# EAGLE schematic Sensor tile (EAGLE 6.6.0)
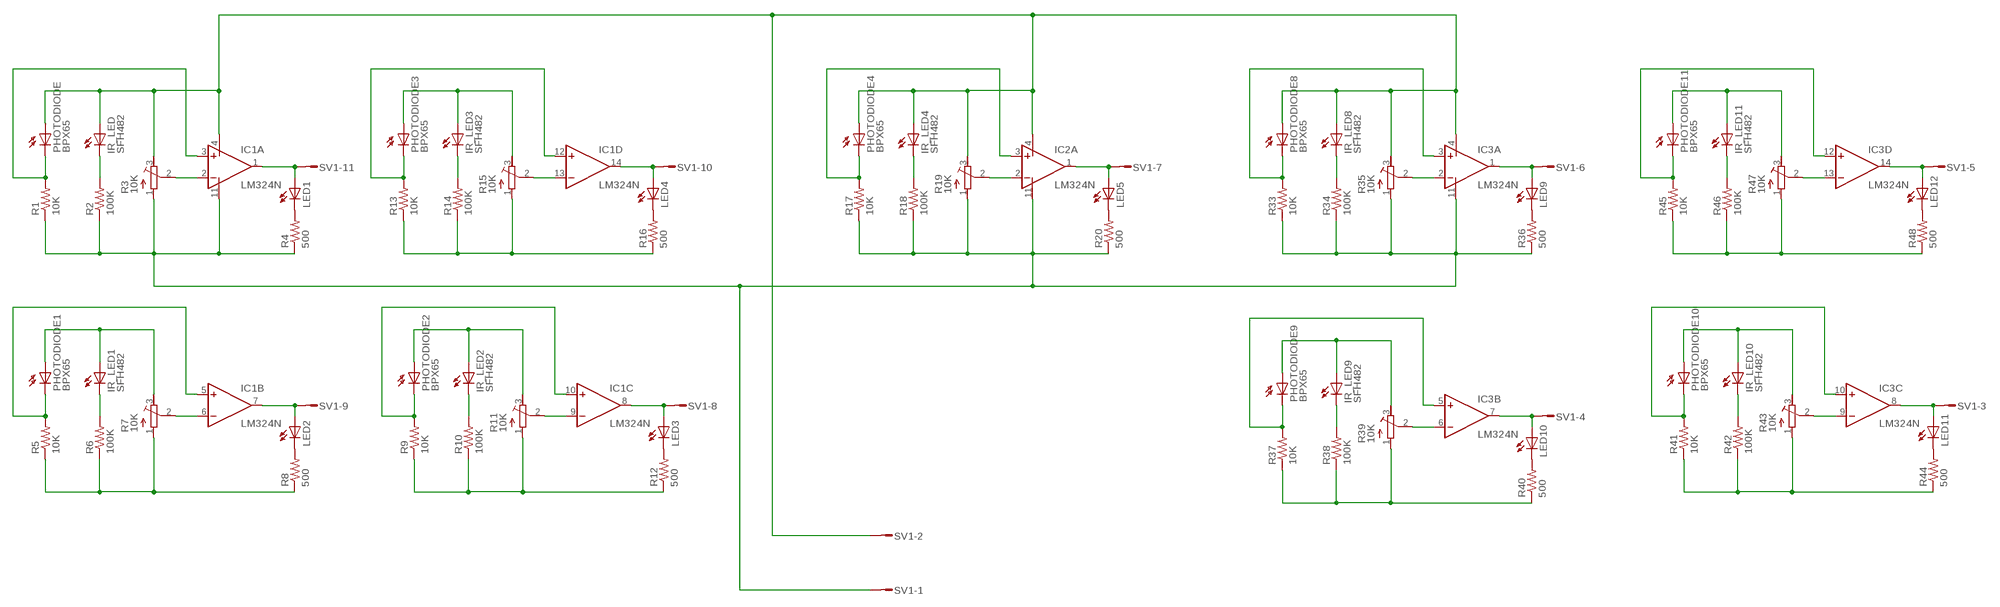
[diagram p0: schematic, sheet 1]

## Parts
IC1  LM324N  [DIL14]
IC2  LM324N  [DIL14]
IC3  LM324N  [DIL14]
IR_LED  SFH482  [SFH482]
IR_LED1  SFH482  [SFH482]
IR_LED2  SFH482  [SFH482]
IR_LED3  SFH482  [SFH482]
IR_LED4  SFH482  [SFH482]
IR_LED8  SFH482  [SFH482]
IR_LED9  SFH482  [SFH482]
IR_LED10  SFH482  [SFH482]
IR_LED11  SFH482  [SFH482]
LED1  LED5MM  [LED5MM]
LED2  LED5MM  [LED5MM]
LED3  LED5MM  [LED5MM]
LED4  LED5MM  [LED5MM]
LED5  LED5MM  [LED5MM]
LED9  LED5MM  [LED5MM]
LED10  LED5MM  [LED5MM]
LED11  LED5MM  [LED5MM]
LED12  LED5MM  [LED5MM]
PHOTODIODE  BPX65  [BPX65]
PHOTODIODE1  BPX65  [BPX65]
PHOTODIODE2  BPX65  [BPX65]
PHOTODIODE3  BPX65  [BPX65]
PHOTODIODE4  BPX65  [BPX65]
PHOTODIODE8  BPX65  [BPX65]
PHOTODIODE9  BPX65  [BPX65]
PHOTODIODE10  BPX65  [BPX65]
PHOTODIODE11  BPX65  [BPX65]
R1  10K  R-US_0204/7  [0204/7]
R2  100K  R-US_0204/7  [0204/7]
R3  10K  R-TRIMM4G/J  [RTRIM4G/J]
R4  500  R-US_0204/7  [0204/7]
R5  10K  R-US_0204/7  [0204/7]
R6  100K  R-US_0204/7  [0204/7]
R7  10K  R-TRIMM4G/J  [RTRIM4G/J]
R8  500  R-US_0204/7  [0204/7]
R9  10K  R-US_0204/7  [0204/7]
R10  100K  R-US_0204/7  [0204/7]
R11  10K  R-TRIMM4G/J  [RTRIM4G/J]
R12  500  R-US_0204/7  [0204/7]
R13  10K  R-US_0204/7  [0204/7]
R14  100K  R-US_0204/7  [0204/7]
R15  10K  R-TRIMM4G/J  [RTRIM4G/J]
R16  500  R-US_0204/7  [0204/7]
R17  10K  R-US_0204/7  [0204/7]
R18  100K  R-US_0204/7  [0204/7]
R19  10K  R-TRIMM4G/J  [RTRIM4G/J]
R20  500  R-US_0204/7  [0204/7]
R33  10K  R-US_0204/7  [0204/7]
R34  100K  R-US_0204/7  [0204/7]
R35  10K  R-TRIMM4G/J  [RTRIM4G/J]
R36  500  R-US_0204/7  [0204/7]
R37  10K  R-US_0204/7  [0204/7]
R38  100K  R-US_0204/7  [0204/7]
R39  10K  R-TRIMM4G/J  [RTRIM4G/J]
R40  500  R-US_0204/7  [0204/7]
R41  10K  R-US_0204/7  [0204/7]
R42  100K  R-US_0204/7  [0204/7]
R43  10K  R-TRIMM4G/J  [RTRIM4G/J]
R44  500  R-US_0204/7  [0204/7]
R45  10K  R-US_0204/7  [0204/7]
R46  100K  R-US_0204/7  [0204/7]
R47  10K  R-TRIMM4G/J  [RTRIM4G/J]
R48  500  R-US_0204/7  [0204/7]
SV1  L11P  [L11P]

## Nets
N$1: IC1.4(P:V+) IC2.4(P:V+) IC3.4(P:V+) IR_LED4.A IR_LED8.A IR_LED.A PHOTODIODE4.A PHOTODIODE8.A PHOTODIODE.A R3.3(E) R19.3(E) R35.3(E) SV1.2
N$2: IC1.3(A:+IN) PHOTODIODE.K(C) R1.2
N$3: IR_LED.K(C) R2.2
N$5: IC1.2(A:-IN) R3.2(S)
N$6: IC1.1(A:OUT) LED1.A SV1.11
N$7: LED1.K(C) R4.2
N$8: IR_LED1.A PHOTODIODE1.A R7.3(E)
N$9: IC1.5(B:+IN) PHOTODIODE1.K(C) R5.2
N$10: IR_LED1.K(C) R6.2
N$11: R5.1 R6.1 R7.1(A) R8.1
N$12: IC1.6(B:-IN) R7.2(S)
N$13: LED2.K(C) R8.2
N$14: IC1.7(B:OUT) LED2.A SV1.9
N$15: IR_LED2.A PHOTODIODE2.A R11.3(E)
N$16: IC1.10(C:+IN) PHOTODIODE2.K(C) R9.2
N$17: IR_LED2.K(C) R10.2
N$18: R9.1 R10.1 R11.1(A) R12.1
N$19: IC1.9(C:-IN) R11.2(S)
N$20: LED3.K(C) R12.2
N$21: IC1.8(C:OUT) LED3.A SV1.8
N$22: IR_LED3.A PHOTODIODE3.A R15.3(E)
N$23: IC1.12(D:+IN) PHOTODIODE3.K(C) R13.2
N$24: IR_LED3.K(C) R14.2
N$25: R13.1 R14.1 R15.1(A) R16.1
N$26: IC1.13(D:-IN) R15.2(S)
N$27: LED4.K(C) R16.2
N$28: IC1.14(D:OUT) LED4.A SV1.10
N$30: IC2.3(A:+IN) PHOTODIODE4.K(C) R17.2
N$31: IR_LED4.K(C) R18.2
N$32: IC1.11(P:V-) IC2.11(P:V-) IC3.11(P:V-) R1.1 R2.1 R3.1(A) R4.1 R17.1 R18.1 R19.1(A) R20.1 R33.1 R34.1 R35.1(A) R36.1 SV1.1
N$33: IC2.2(A:-IN) R19.2(S)
N$34: LED5.K(C) R20.2
N$35: IC2.1(A:OUT) LED5.A SV1.7
N$58: IC3.3(A:+IN) PHOTODIODE8.K(C) R33.2
N$59: IR_LED8.K(C) R34.2
N$61: IC3.2(A:-IN) R35.2(S)
N$62: LED9.K(C) R36.2
N$63: IC3.1(A:OUT) LED9.A SV1.6
N$64: IR_LED9.A PHOTODIODE9.A R39.3(E)
N$65: IC3.5(B:+IN) PHOTODIODE9.K(C) R37.2
N$66: IR_LED9.K(C) R38.2
N$67: R37.1 R38.1 R39.1(A) R40.1
N$68: IC3.6(B:-IN) R39.2(S)
N$69: LED10.K(C) R40.2
N$70: IC3.7(B:OUT) LED10.A SV1.4
N$71: IR_LED10.A PHOTODIODE10.A R43.3(E)
N$72: IC3.10(C:+IN) PHOTODIODE10.K(C) R41.2
N$73: IR_LED10.K(C) R42.2
N$74: R41.1 R42.1 R43.1(A) R44.1
N$75: IC3.9(C:-IN) R43.2(S)
N$76: LED11.K(C) R44.2
N$77: IC3.8(C:OUT) LED11.A SV1.3
N$78: IR_LED11.A PHOTODIODE11.A R47.3(E)
N$79: IC3.12(D:+IN) PHOTODIODE11.K(C) R45.2
N$80: IR_LED11.K(C) R46.2
N$81: R45.1 R46.1 R47.1(A) R48.1
N$82: IC3.13(D:-IN) R47.2(S)
N$83: LED12.K(C) R48.2
N$84: IC3.14(D:OUT) LED12.A SV1.5
Unconnected: IC2.5(B:+IN) IC2.6(B:-IN) IC2.7(B:OUT) IC2.8(C:OUT) IC2.9(C:-IN) IC2.10(C:+IN) IC2.12(D:+IN) IC2.13(D:-IN) IC2.14(D:OUT)

## Library data of the parts
IC1-IC3 = linear:LM324: OP AMP
IR_LED IR_LED1-IR_LED4 IR_LED8-IR_LED11 = led:SFH482: IR LED infrared emitting diode, Infineon
LED1-LED5 LED9-LED12 = led:LED: LED OSRAM: - CHIPLED LG R971, LG N971, LY N971, LG Q971, LY Q971, LO R971, LY R971 LH N974, LH R974 LS Q976, LO Q976, LY Q976 LO Q996 - Hyper CHIPLED LW Q18S LB Q993, LB Q99A, LB R99A - SideLED LS A670, LO A670, LY A670, LG A670, LP A670 LB A673, LV A673, LT A673, LW A673 LH A674 LY A675 LS A676, LA A676, LO A676, LY A676, LW A676 LS A679, LY A679, LG A679 - Hyper Micro SIDELED® LS Y876, LA Y876, LO Y876, LY Y876 LT Y87S - SmartLED LW L88C, LW L88S LB L89C, LB L89S, LG L890 LS L89K, LO L89K, LY L89K LS L896, LA L896, LO L896, LY L896 - TOPLED LS T670, LO T670, LY T670, LG T670, LP T670 LSG T670, LSP T670, LSY T670, LOP T670, LYG T670 LG T671, LOG T671, LSG T671 LB T673, LV T673, LT T673, LW T673 LH T674 LS T676, LA T676, LO T676, LY T676, LB T676, LH T676, LSB T676, LW T676 LB T67C, LV T67C, LT T67C, LS T67K, LO T67K, LY T67K, LW E67C LS E67B, LA E67B, LO E67B, LY E67B, LB E67C, LV E67C, LT E67C LW T67C LS T679, LY T679, LG T679 LS T770, LO T770, LY T770, LG T770, LP T770 LB T773, LV T773, LT T773, LW T773 LH T774 LS E675, LA E675, LY E675, LS T675 LS T776, LA T776, LO T776, LY T776, LB T776 LHGB T686 LT T68C, LB T68C - Hyper Mini TOPLED® LB M676 - Mini TOPLED Santana® LG M470 LS M47K, LO M47K, LY M47K Source: http://www.osram.convergy.de LUXEON: - LUMILED® LXK2-PW12-R00, LXK2-PW12-S00, LXK2-PW14-U00, LXK2-PW14-V00 LXK2-PM12-R00, LXK2-PM12-S00, LXK2-PM14-U00 LXK2-PE12-Q00, LXK2-PE12-R00, LXK2-PE12-S00, LXK2-PE14-T00, LXK2-PE14-U00 LXK2-PB12-K00, LXK2-PB12-L00, LXK2-PB12-M00, LXK2-PB14-N00, LXK2-PB14-P00, LXK2-PB14-Q00 LXK2-PR12-L00, LXK2-PR12-M00, LXK2-PR14-Q00, LXK2-PR14-R00 LXK2-PD12-Q00, LXK2-PD12-R00, LXK2-PD12-S00 LXK2-PH12-R00, LXK2-PH12-S00 LXK2-PL12-P00, LXK2-PL12-Q00, LXK2-PL12-R00 Source: www.luxeon.com KINGBRIGHT: KA-3528ASYC Source: www.kingbright.com
PHOTODIODE PHOTODIODE1-PHOTODIODE4 PHOTODIODE8-PHOTODIODE11 = opto-trans-siemens:BPX65: PHOTO DIODE; MPN: BPX65.; OC_FARNELL: 327451; OC_NEWARK: 06WX2764
R1 R2 R4-R6 R8-R10 R12-R14 R16-R18 R20 R33 R34 R36-R38 R40-R42 R44-R46 R48 = rcl:R-US_: RESISTOR, American symbol
R3 R7 R11 R15 R19 R35 R39 R43 R47 = rcl:R-TRIMM: Trimm resistor
SV1 = con-amp-mt:L11P: AMP MT CONNECTOR; OC_FARNELL: unknown; OC_NEWARK: unknown